# Altium schematic sheet 10-RF_WIFI.SchDoc
size C; SheetNumber: 10; SheetTotal: 12; SPICEModelCacheVJLQFKRM: <root> / <DocumentId>VJLQFKRM</DocumentId> / <CacheFrame Number="0"> / <Model Name="umk105bj104_v-f" Kind="CKT"> / <Text>* UMK105BJ104_V-F     SPICE MODEL  ( General Type ) / *-------------------------------------------------------------------------------------------------------- / * Model Generated by TAIYO YUDEN Corporation (http://www.ty-top.com) / * Version 1.0 / * TAIYO YUDEN Control No. 170508_120810 / * Copyright(c) 2012 TAIYO YUDEN CO.,LTD. All Rights Reserved. / *-------------------------------------------------------------------------------------------------------- / * / * Products Name : Multilayer Ceramic Capacitors / * / * Characteristics : / *     Capacitance : 0.1 uF , Rated Voltage : 50V , TCC : X5R / *     Case Size : 1.0 x 0.5 / 0.039 x 0.02 [mm/inch] , Thickness : 0.5 / 0.02 [mm/inch] / *     (Conditions: Temperature = 25 degC , DC Bias Current/Voltage = 0A / 0V) / * / * Frequency Range : 40Hz - 3GHz / * / * External Node Assignments : / * / *  1  o---| |---o  2 / * / *-------------------------------------------------------------------------------------------------------- / .SubCkt UMK105BJ104_V-F 1 2 / **************************** / C0 1 110 0.068998u / Cm 1 101 0.01292u / C1 101 102 0.041907u / Rc1 101 102 25.432k / C2 102 103 0.021417u / Rc2 102 103 1.1926k / C3 103 110 0.016759u / Rc3 103 110 12.415 / C2m 1 301 0.022631u / C21 301 302 0.1608u / Rc21 301 302 202.11k / C22 302 303 0.054305u / Rc22 302 303 87.274k / C23 303 304 0.14296u / Rc23 303 304 7.7387k / C24 304 305 0.08092u / Rc24 304 305 2.9339k / C25 305 306 0.04951u / Rc25 305 306 2.1733k / C26 306 307 0.043691u / Rc26 306 307 191.91 / C27 307 308 0.016759u / Rc27 307 308 147.23 / C28 308 309 5027.4p / Rc28 308 309 97.746 / C29 309 110 570.66p / Rc29 309 110 12.365 / Rp0 1 110 5G / L0 110 120 0.23341n / Lm 120 130 0.14222n / L1 120 121 0.036554n / RL1 121 130 1.698 / L2 120 122 0.11188n / RL2 122 130 0.33926 / L3 120 123 1.1401n / RL3 123 130 1.655 / CR 120 124 0.028892u / LR 124 125 0.10347n / RR 125 130 0.14446 / CL 130 140 2.048p / LL 130 140 0.1545n / RL 130 140 189.66 / Rs 140 2 26.069m / **************************** / .ends UMK105BJ104_V-F</Text> / </Model> / </CacheFrame> / </root>
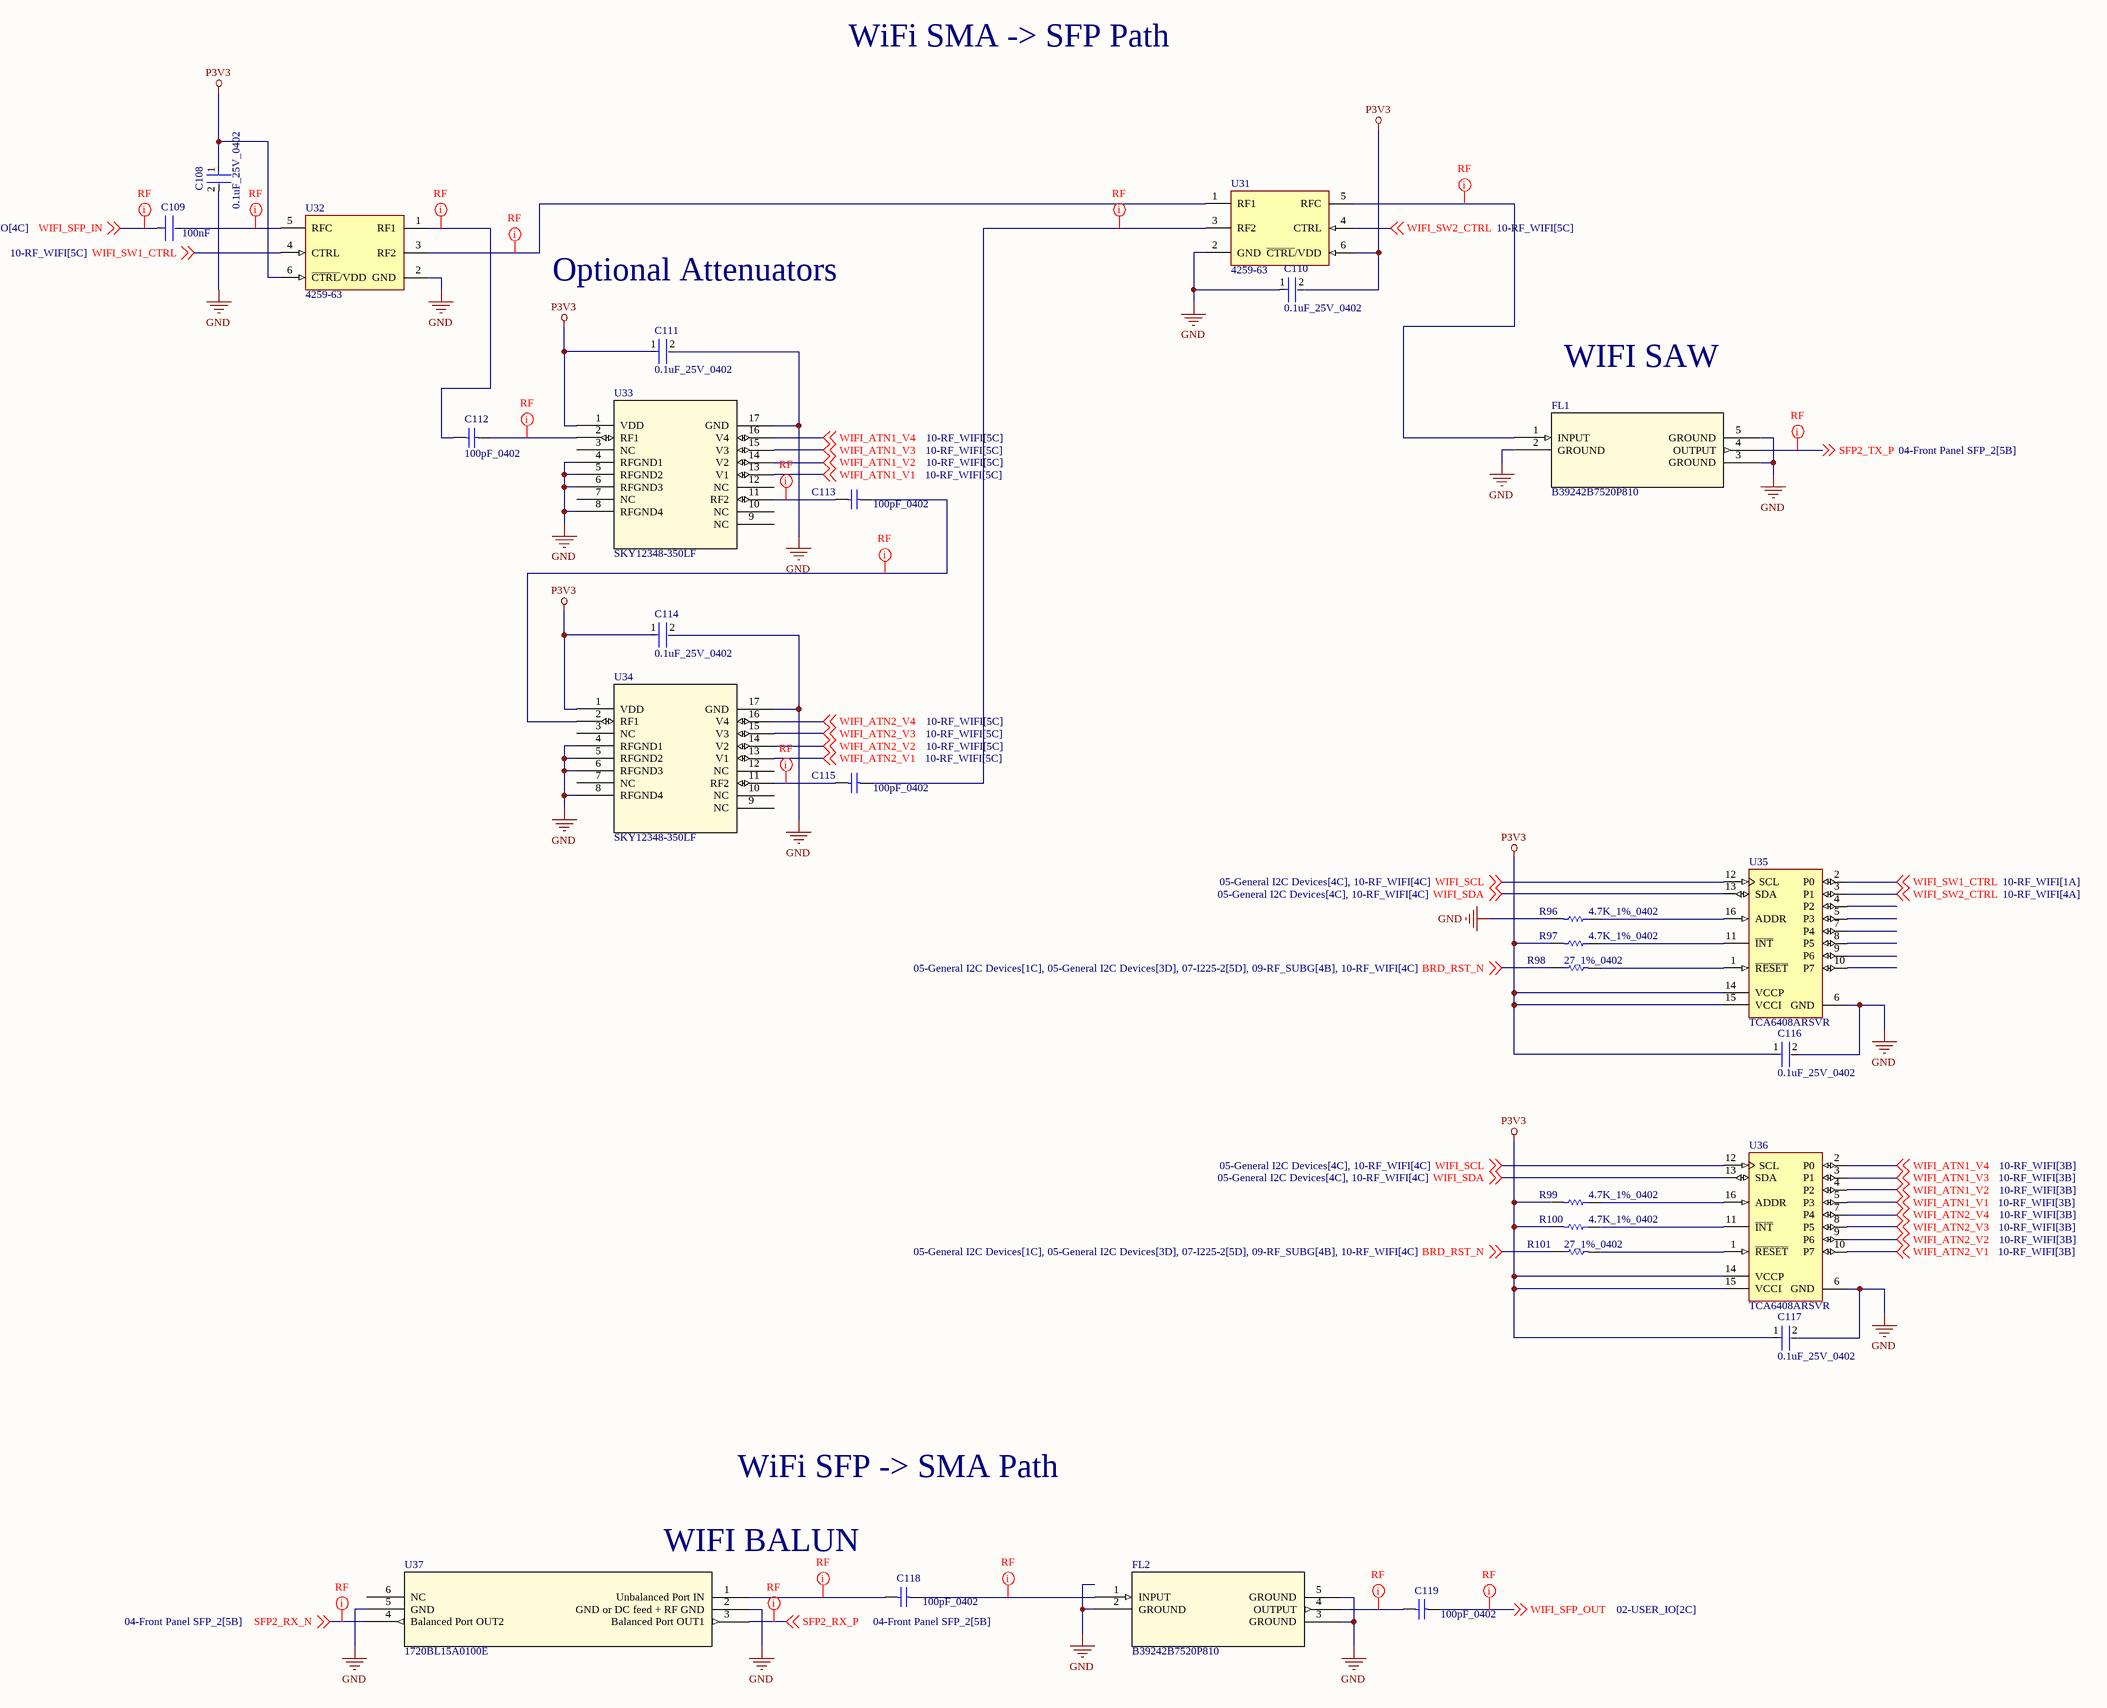
[diagram p0: 10-RF_WIFI.SchDoc]

## Parts
C108  0.1uF_25V_0402  [FP-0402-L_1_0_1-W_0_5_0_1-IPC_C]
C109  100nF  [FP-0402-L_1_0_0_05-W_0_5-IPC_B]
C110  0.1uF_25V_0402  [FP-0402-L_1_0_1-W_0_5_0_1-IPC_C]
C111  0.1uF_25V_0402  [FP-0402-L_1_0_1-W_0_5_0_1-IPC_C]
C112  100pF_0402  [CAPC1005X55X25ML05T10]
C113  100pF_0402  [CAPC1005X55X25ML05T10]
C114  0.1uF_25V_0402  [FP-0402-L_1_0_1-W_0_5_0_1-IPC_C]
C115  100pF_0402  [CAPC1005X55X25ML05T10]
C116  0.1uF_25V_0402  [FP-0402-L_1_0_1-W_0_5_0_1-IPC_C]
C117  0.1uF_25V_0402  [FP-0402-L_1_0_1-W_0_5_0_1-IPC_C]
C118  100pF_0402  [CAPC1005X55X25ML05T10]
C119  100pF_0402  [CAPC1005X55X25ML05T10]
FL1  B39242B7520P810  [SMD5_SAW-B7520_QUA]
FL2  B39242B7520P810  [SMD5_SAW-B7520_QUA]
R96  4.7K_1%_0402  [RESC1005X40X25NL10T10]
R97  4.7K_1%_0402  [RESC1005X40X25NL10T10]
R98  27_1%_0402  [RESC1005X40X25NL05T05]
R99  4.7K_1%_0402  [RESC1005X40X25NL10T10]
R100  4.7K_1%_0402  [RESC1005X40X25NL10T10]
R101  27_1%_0402  [RESC1005X40X25NL05T05]
U31  4259-63  [PERE-SC-70-6_M]
U32  4259-63  [PERE-SC-70-6_M]
U33  SKY12348-350LF  [SKY12348-350LF_SKY]
U34  SKY12348-350LF  [SKY12348-350LF_SKY]
U35  TCA6408ARSVR  [RSV0016A_V]
U36  TCA6408ARSVR  [RSV0016A_V]
U37  1720BL15A0100E  [SMT_15B0050E_JOT]

## Nets
GND: C108.2 C110.1 C111.2 C114.2 C116.2 C117.2 FL1.2(GROUND) FL1.3(GROUND) FL1.5(GROUND) FL2.2(GROUND) FL2.3(GROUND) FL2.5(GROUND) R96.2 U31.2(GND) U32.2(GND) U33.4(RFGND1) U33.5(RFGND2) U33.6(RFGND3) U33.8(RFGND4) U33.17(GND) U34.4(RFGND1) U34.5(RFGND2) U34.6(RFGND3) U34.8(RFGND4) U34.17(GND) U35.6(GND) U36.6(GND) U37.2(GND_or_DC_feed_+_RF_GND) U37.5(GND)
P3V3: C108.1 C110.2 C111.1 C114.1 C116.1 C117.1 R97.2 R99.2 R100.2 U31.6(~{CTRL}/VDD) U32.6(~{CTRL}/VDD) U33.1(VDD) U34.1(VDD) U35.14(VCCP) U35.15(VCCI) U36.14(VCCP) U36.15(VCCI)
BRD_RST_N: R98.1 R101.1 ; off-sheet BRD_RST_N
SFP2_RX_N: U37.4(Balanced_Port_OUT2) ; off-sheet SFP2_RX_N
SFP2_RX_P: U37.3(Balanced_Port_OUT1) ; off-sheet SFP2_RX_P
SFP2_TX_P: FL1.4(OUTPUT) ; off-sheet SFP2_TX_P
WIFI_ATN1_V1: U33.13(V1) U36.5(P3) ; off-sheet WIFI_ATN1_V1
WIFI_ATN1_V2: U33.14(V2) U36.4(P2) ; off-sheet WIFI_ATN1_V2
WIFI_ATN1_V3: U33.15(V3) U36.3(P1) ; off-sheet WIFI_ATN1_V3
WIFI_ATN1_V4: U33.16(V4) U36.2(P0) ; off-sheet WIFI_ATN1_V4
WIFI_ATN2_V1: U34.13(V1) U36.10(P7) ; off-sheet WIFI_ATN2_V1
WIFI_ATN2_V2: U34.14(V2) U36.9(P6) ; off-sheet WIFI_ATN2_V2
WIFI_ATN2_V3: U34.15(V3) U36.8(P5) ; off-sheet WIFI_ATN2_V3
WIFI_ATN2_V4: U34.16(V4) U36.7(P4) ; off-sheet WIFI_ATN2_V4
WIFI_SCL: U35.12(SCL) U36.12(SCL) ; off-sheet WIFI_SCL
WIFI_SDA: U35.13(SDA) U36.13(SDA) ; off-sheet WIFI_SDA
WIFI_SFP_IN: C109.1 ; off-sheet WIFI_SFP_IN
WIFI_SFP_OUT: C119.2 ; off-sheet WIFI_SFP_OUT
WIFI_SW1_CTRL: U32.4(CTRL) U35.2(P0) ; off-sheet WIFI_SW1_CTRL
WIFI_SW2_CTRL: U31.4(CTRL) U35.3(P1) ; off-sheet WIFI_SW2_CTRL
NetC109_2: C109.2 U32.5(RFC)
NetC112_1: C112.1 U32.1(RF1)
NetC112_2: C112.2 U33.2(RF1)
NetC113_1: C113.1 U33.11(RF2)
NetC113_2: C113.2 U34.2(RF1)
NetC115_1: C115.1 U34.11(RF2)
NetC115_2: C115.2 U31.3(RF2)
NetC118_1: C118.1 U37.1(Unbalanced_Port_IN)
NetC118_2: C118.2 FL2.1(INPUT)
NetC119_1: C119.1 FL2.4(OUTPUT)
NetFL1_1: FL1.1(INPUT) U31.5(RFC)
NetR96_1: R96.1 U35.16(ADDR)
NetR97_1: R97.1 U35.11(~{INT})
NetR98_2: R98.2 U35.1(~{RESET})
NetR99_1: R99.1 U36.16(ADDR)
NetR100_1: R100.1 U36.11(~{INT})
NetR101_2: R101.2 U36.1(~{RESET})
NetU31_1: U31.1(RF1) U32.3(RF2)

Not connected (* = marked no-connect by the designer): U33 3(NC) 7(NC) 9(NC) 10(NC) 12(NC); U34 3(NC) 7(NC) 9(NC) 10(NC) 12(NC); U35 4(P2) 5(P3) 7(P4) 8(P5) 9(P6) 10(P7); U37 6(NC)

## Layout directives
net class RF: NetC109_2, NetC112_1, NetC112_2, NetC113_1, NetC113_2, NetC115_1, NetC115_2, NetC118_1, NetC118_2, NetC119_1, NetFL1_1, NetU31_1, SFP2_RX_N, SFP2_RX_P, SFP2_TX_P, WIFI_SFP_IN, WIFI_SFP_OUT

## Notes on the sheet
- WiFi SMA -> SFP Path
- Optional Attenuators
- WIFI SAW
- WiFi SFP -> SMA Path
- (near U37) WIFI BALUN

## Library data of the parts
C108 C110 C111 C114 C116 C117 = CMP-2008-02519-2: General Purpose Ceramic Capacitor, 0402, 100nF, 10%, X7R, 15%, 25V; Package Quantity: 1; Capacitance: 100nF; Min Operating Temperature: -55°C; Voltage: 25V; Voltage Rating: 25V; Construction: Flat; Max Operating Temperature: 125°C; Radiation Hardening: No; Depth: 0.5mm; Thickness: 0.022inch; Voltage Rating (DC): 25V; Number of Pins: 2; Lead Free: Lead Free; Series: -; REACH SVHC: No SVHC; Length: 1mm; Dielectric: X7R; RoHS Compliant: Yes; Mount: Surface Mount; Packaging: Tape and Reel; Case/Package: 0402; Case Code (Imperial): 0402; Termination: SMD/SMT; Width: 0.02inch; Case Code (Metric): 1005; Tolerance: 10%
C109 = CMP-14477-000330-2: None; Voltage Rating (DC): 50V; Dielectric: X5R; Tolerance: 10%; RoHS Compliant: Yes; Termination: SMD/SMT; Packaging: Tape and Reel; Capacitance: 100nF; Height: 0.5mm; Halogen Free: Halogen Free; Case Code (Metric): 1005; Width: 0.02inch; Max Operating Temperature: 85°C; Voltage Rating: 50V; Min Operating Temperature: -55°C; Package Quantity: 10000; Case/Package: 0402; Case Code (Imperial): 0402; Length: 0.039inch; Thickness: 0.022inch; Mount: Surface Mount
C112 C113 C115 C118 C119 = CMP-2008-03915-1: Manufacturer: Murata; Part Number: GRM1555C1H101JA01D
FL1 FL2 = B39242B7520P810: No Description Available; Mfr_Name: Qualcomm; Type: SAW Filters; RefDes: RefDes
R96 R97 R99 R100 = CMP-2002-05217-1: Manufacturer: Bourns; Part Number: CR0402-FX-4701GLF
R98 R101 = CMP-2002-08434-1: Part Number: CRCW040227R0FKED; Manufacturer: Vishay Dale
U31 U32 = CMP-2000-05298-1: IC RF Switch SPDT, 50 Ohm, 6-Pin SC70, RoHS, Tape and Reel; Manufacturer: Peregrine Semiconductor; P1dB: 29dBm(typ)IP1dB; Topology: Reflective; Frequency - Upper: 3GHz; Insertion Loss @ Frequency: 0.5dB@2GHz; IIP3: 55dBm(typ); Voltage - Supply: 1.8V~3.3V; Other Names: 1046-1011-24259-63-ND425963PE4259PE4259SCBC-ZPE4259SCBC-Z-ND; Isolation @ Frequency: 20dB@2GHz(typ); Frequency - Lower: 10MHz; Online Catalog: PE4259; Impedance: 50Ohm; RF Type: GeneralPurpose; Series: UltraCMOS; Manufacturer URL: http://www.psemi.com/; Package Description: 6-Pin Small Outline Transistor, Body 2.05 x 1.25 mm, Pitch 0.65 mm; Family: RFSwitches; Packaging: Tape&Reel(TR); Features: Single/DualLineControl; Package / Case: 6-TSSOP,SC-88,SOT-363; Operating Temperature: -40degC~85degC; Circuit: SPDT; Supplier Device Package: SC-70-6; Standard Package: 3,000; Datasheet URL: https://datasheet.ciiva.com/15100/getdatasheetpartid-685660-15100501.pdf; Category: RF/IFandRFID; Datasheet Version: Jan-11; Package Reference: SC-70-6
U33 U34 = SKY12348-350LF: No Description Available; Mfr_Name: Skyworks; RefDes: RefDes; Type: Type
U35 U36 = CMP-0314-00021-2: Low-Voltage 8-Bit I2C and SMBus I/O Expander, 1.65 to 5.5 V, -40 to 85 degC, 16-pin UQFN (RSV), Green (RoHS & no Sb/Br); Manufacturer: Texas Instruments; Configuration Registers: Yes; Max Frequency(kHz): 400; # of I/Os: 8; SubFamily: I2C IO Expander; I2C Address: 0100 00x; VCC(Min)(V): 1.65; VCC(Max)(V): 5.5; Reset Input: Yes; ComponentLink2URL: http://www.ti.com/litv/pdf/mpqf115g; PackageVersion: revD, Dec-2011; No. of Outputs: 8; PackageReference: RSV0016A; DatasheetVersion: SCPS192C; fSCLK(Max)(MHz): 400; Mounting Technology: Surface Mount; ComponentLink1Description: Datasheet; Push-Pull I/O Type: Yes; Code_JEDEC: MO-288*; PackageDescription: 16-Leads Plastic Quad Flatpack No-Lead, 2.6 x 1.8 x 0.5 mm Body, 0.4 mm Pitch; ComponentLink1URL: http://www.ti.com/general/docs/lit/getliterature.tsp?genericPartNumber=TCA6408A&fileType=pdf; Interrupt Output: Yes; PartNumber: TCA6408ARSVR; Eco-Plan: Green (RoHS & no Sb/Br); Low Power: Yes; Vcc range(V): 1.65 to 5.5; ComponentLink2Description: Package Specification; 5V Tolerant I/O: Yes
U37 = 1720BL15A0100E: No Description Available; Mfr_Name: Johanson Technology; RefDes: RefDes; Type: Type